# EAGLE design cpu-OLED-TOP2 (EAGLE 7.6.0)
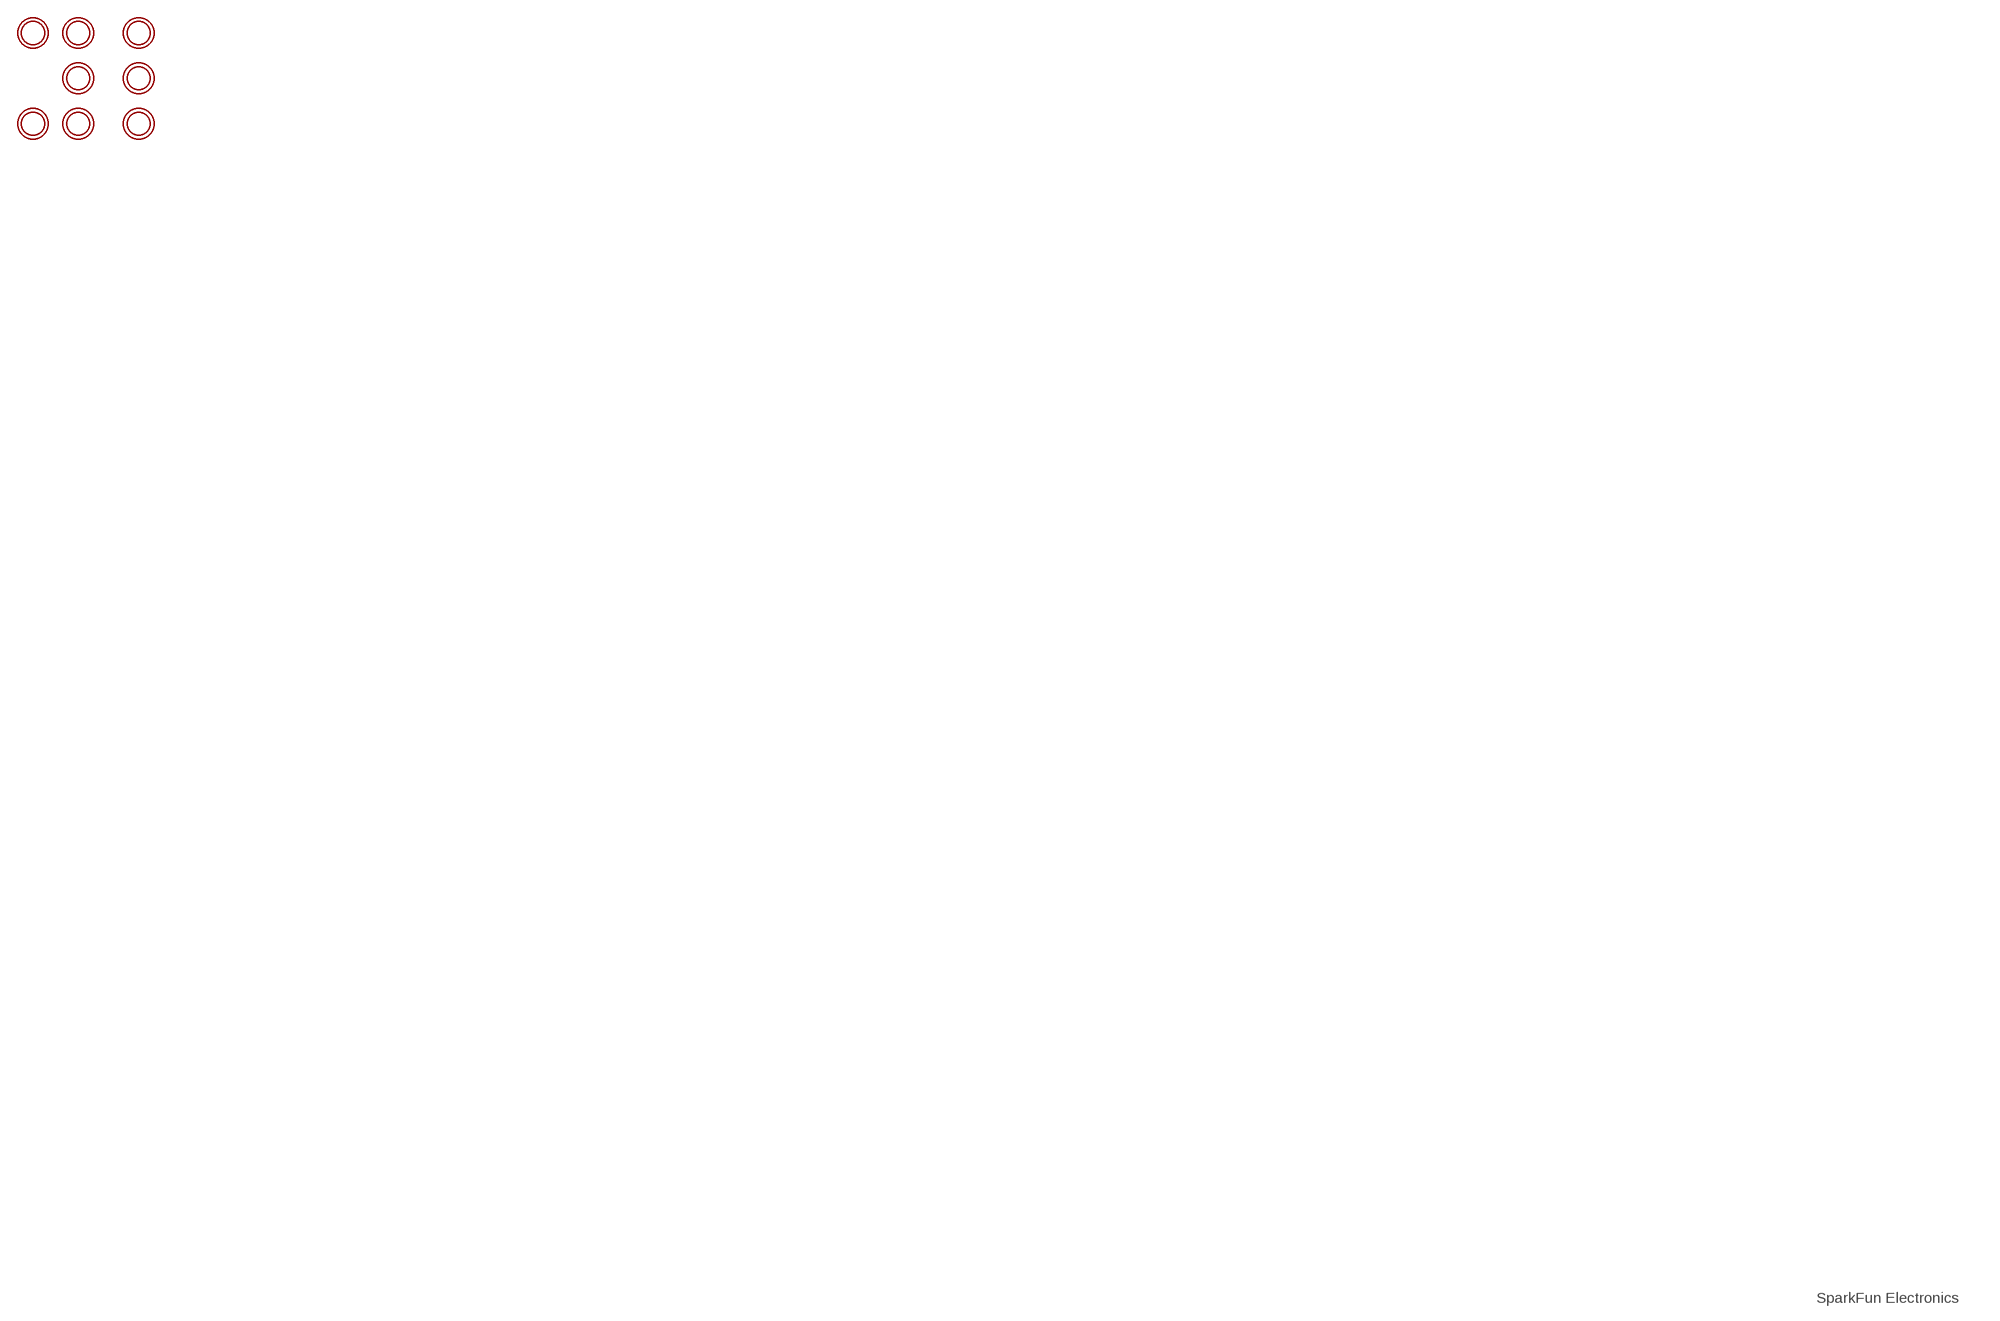
[diagram p0: schematic, sheet 1]

## Parts
U$3  MOUNTINGHOLE2.0  [MOUNTINGHOLE_2.0_PLATED]
U$4  MOUNTINGHOLE2.0  [MOUNTINGHOLE_2.0_PLATED]
U$5  MOUNTINGHOLE2.0  [MOUNTINGHOLE_2.0_PLATED]
U$6  MOUNTINGHOLE2.0  [MOUNTINGHOLE_2.0_PLATED]
U$7  MOUNTINGHOLE2.0  [MOUNTINGHOLE_2.0_PLATED]
U$8  MOUNTINGHOLE2.0  [MOUNTINGHOLE_2.0_PLATED]
U$9  MOUNTINGHOLE2.0  [MOUNTINGHOLE_2.0_PLATED]
U$11  MOUNTINGHOLE2.0  [MOUNTINGHOLE_2.0_PLATED]

## Notes on the sheet
- SparkFun Electronics

## Library data of the parts
U$3-U$9 U$11 = microbuilder:MOUNTINGHOLE: Mounting Hole

## Net classes
0 default: width 0.203 mm, drill 0.356 mm, clearance 0.203 mm
1 vcc: width 0.254 mm, drill 0.356 mm, clearance 0.254 mm
2 gnd: width 0.254 mm, drill 0.356 mm, clearance 0.356 mm

## Board
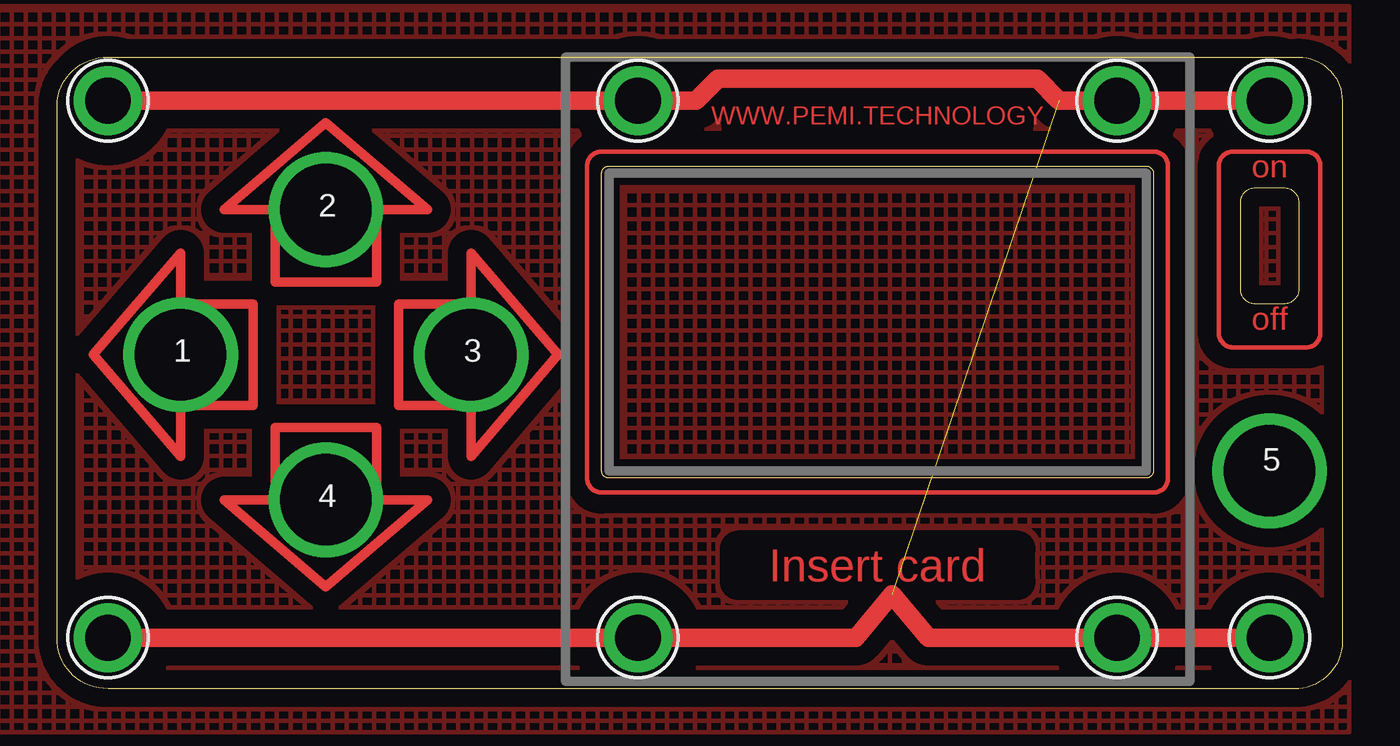
[diagram p1: board, top side]
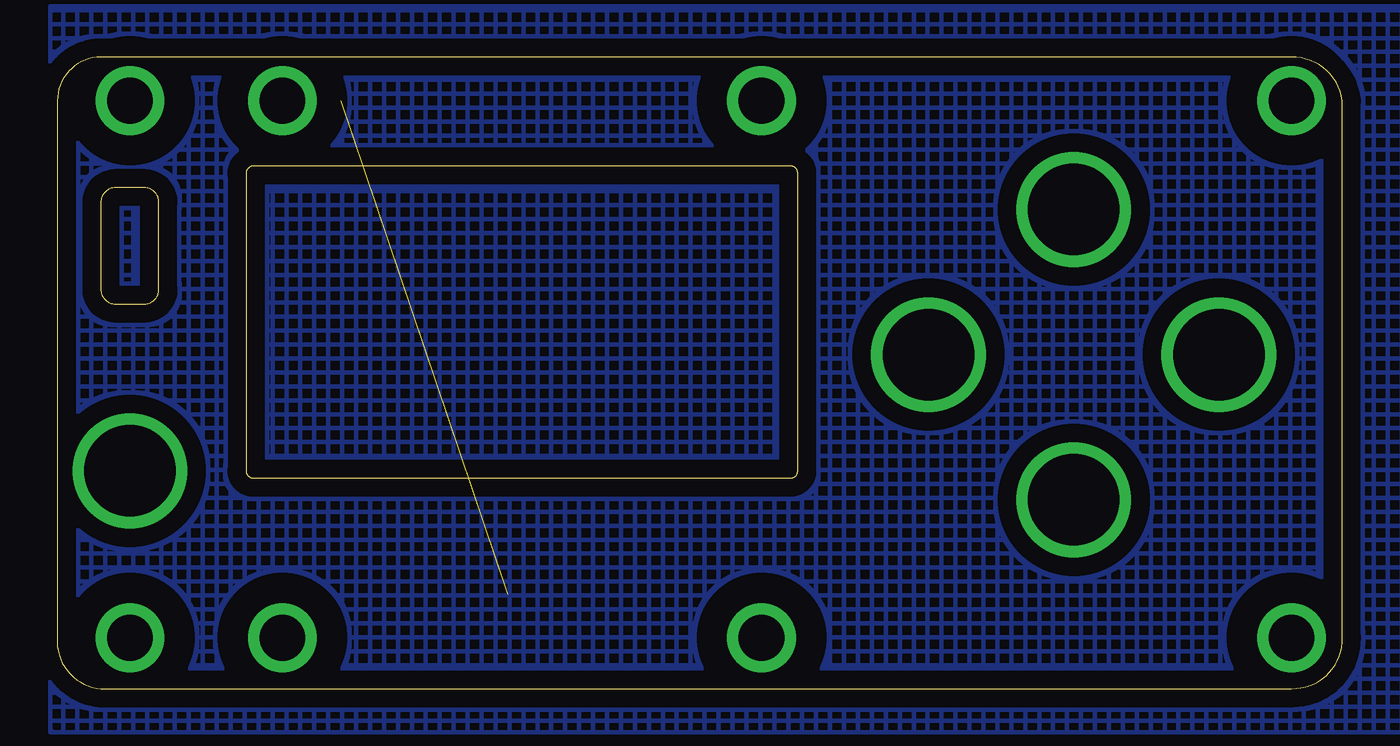
[diagram p2: board, bottom side, seen from below]

Size 56.2 x 27.62 mm. Coordinates in mm from the lower left corner, seen from the top.
Outline: 0,25.72 arc-83 2.22,27.62 54.29,27.62 arc-90 56.2,25.72 56.2,2.22 arc-90 54.29,0 2.22,0 arc-93 0,2.22 0,25.72
Outline: 52.39,16.83 arc-90 51.75,17.46 51.75,21.27 arc-90 52.39,21.91 53.66,21.91 arc-90 54.29,21.27 54.29,17.46 arc-90 53.66,16.83 52.39,16.83
Outline: 24.13,22.86 47.62,22.86 arc-90 47.94,22.54 47.94,9.52 arc-90 47.62,9.21 24.13,9.21 arc-90 23.81,9.52 23.81,22.54 arc-90 24.13,22.86
Copper layers (1*16): Top 0.035mm / dielectric 1.5mm / Bottom 0.035mm
Design rules "SparkFun": minimum track width 8mil, minimum drill 20mil, track to track 8mil, track to pad 8mil, pad to pad 8mil, via to via 8mil, smd to smd 8mil, copper to edge 9mil, drill to drill 8mil, minimum pad ring 12mil, minimum via ring 10mil, stop-mask expansion 4mil, vias tented up to drill 20mil, thermal gap 10mil

### Footprints (pad centres in the part's own frame; a part is rotated, then mirrored left to right if it is on the bottom)
MOUNTINGHOLE_2.0_PLATED = drill 2 pad 3: P$1 0,0

### Placement (x,y rotation side)
U$3  25.4,2.22 90 top
U$4  46.36,2.22 90 top
U$5  2.22,2.22 0 top
U$6  25.4,25.72 90 top
U$7  2.22,25.72 0 top
U$8  53.02,2.22 0 top
U$9  46.36,25.72 90 top
U$11  53.02,25.72 90 top

### Tracks (layer width: path | path; a pad name or v marks a point on that pad's centre or on a via)
GND
  pour Bottom (isolate 0.813, hatched): 56.52,29.84 -2.86,29.84 -2.86,-1.91 56.52,-1.91
GND1
  pour Top (isolate 0.813, hatched): -2.86,29.84 56.52,29.84 56.52,-1.91 -2.86,-1.91
N$1  (via drill 4)
  other vias: 53.02,9.52
N$2  (via drill 4)
  other vias: 11.75,8.25
N$3  (via drill 4)
  other vias: 11.75,20.95
N$4  (via drill 4)
  other vias: 5.4,14.61
N$5  (via drill 4)
  other vias: 18.1,14.61
N$6
  Top 0.406: 1.59,14.61 5.4,19.05 5.4,16.83 8.57,16.83 8.57,12.38 5.4,12.38 5.4,10.16 1.59,14.61
N$7
  Top 0.406: 11.75,4.45 7.3,8.25 9.53,8.25 9.53,11.43 13.97,11.43 13.97,8.25 16.19,8.25 11.75,4.45
N$8
  Top 0.203: 51.44,14.92 arc-90 50.8,15.56 50.8,22.86 arc-90 51.44,23.49 54.61,23.49 arc-90 55.25,22.86 55.25,15.56 arc-90 54.61,14.92 51.44,14.92
N$9
  Top 0.406: 21.91,14.61 18.1,10.16 18.1,12.38 14.92,12.38 14.92,16.83 18.1,16.83 18.1,19.05 21.91,14.61
N$10
  Top 0.406: 11.75,24.77 16.19,20.95 13.97,20.95 13.97,17.78 9.53,17.78 9.53,20.95 7.3,20.95 11.75,24.77
N$11  (1 unrouted)
  Top 0.813: 51.44,25.72 43.81,25.72 42.86,26.67 28.89,26.67 27.94,25.72 3.49,25.72 | 51.44,2.22 38.1,2.22 36.51,4.13 34.93,2.22 3.49,2.22
N$51
  Top 0.203: 23.81,8.57 arc-90 23.18,9.21 23.18,22.86 arc-90 23.81,23.49 47.94,23.49 arc-90 48.58,22.86 48.58,9.21 arc-90 47.94,8.57 23.81,8.57

### Text on the board
Top: WWW.PEMI.TECHNOLOGY | on | off | Insert card
tNames: 2 | 1 | 3 | 5 | 4
tStop: WWW.PEMI.TECHNOLOGY | on | off | Insert card